# Altium project RaspberryPi.PrjPcb
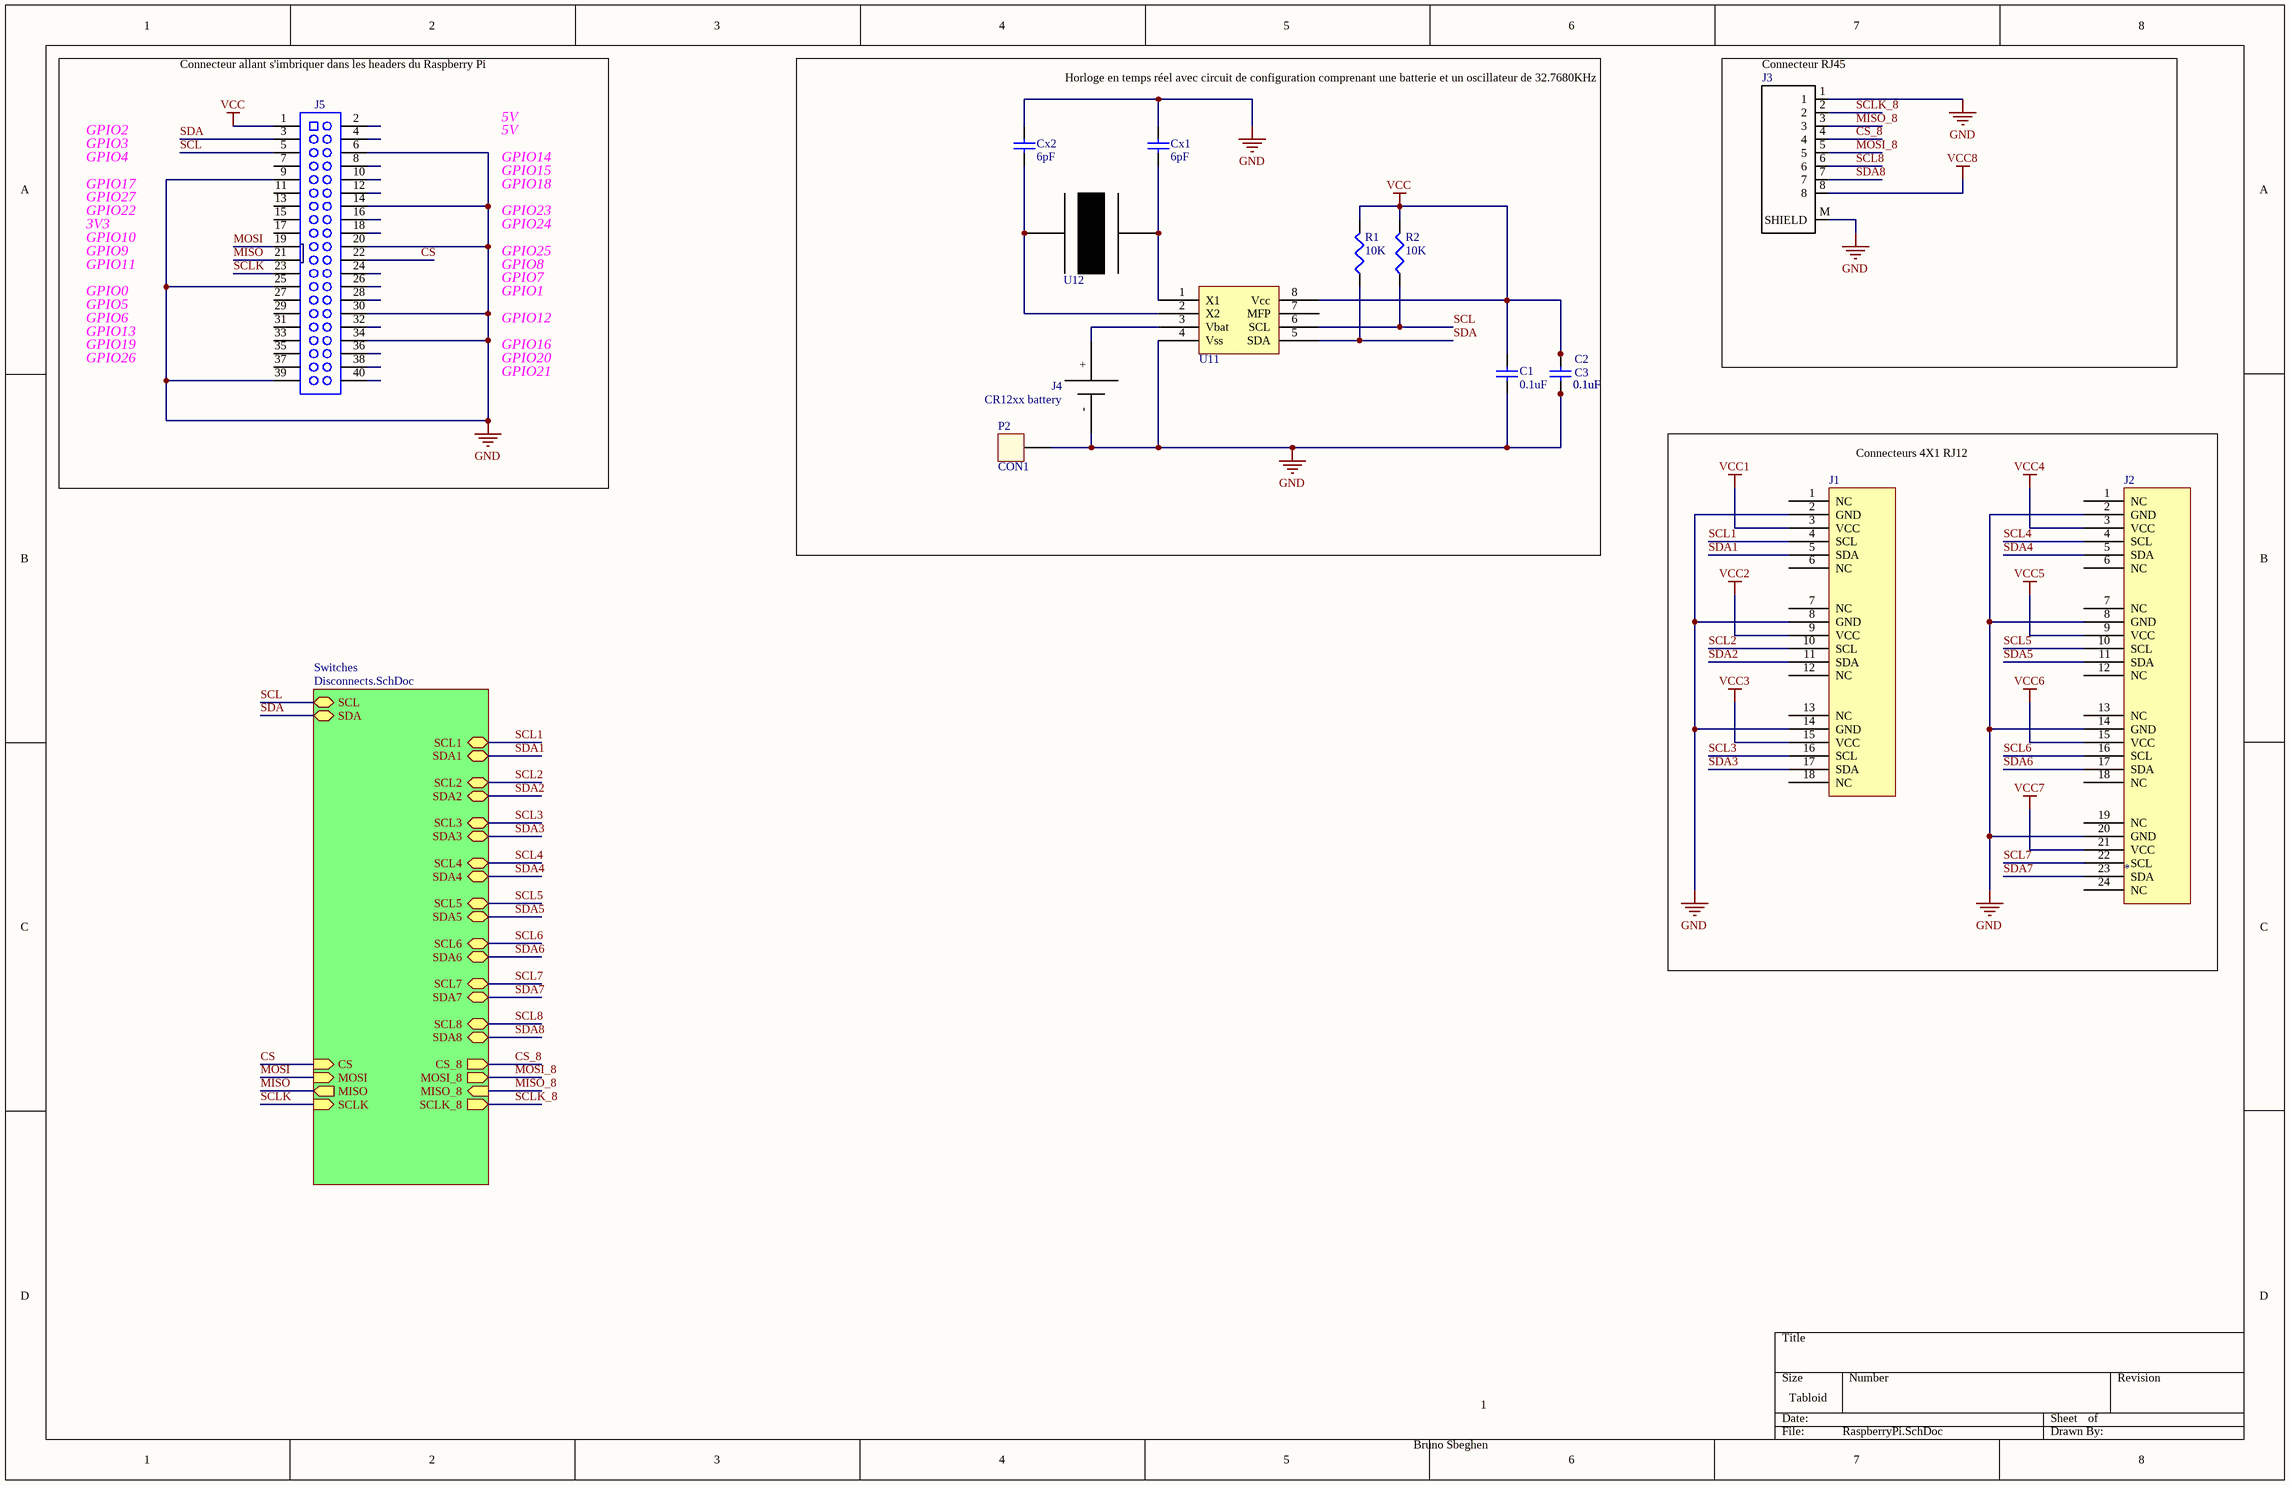
[diagram p0: RaspberryPi.SchDoc]
RevisionGlobal: 1.1; DrawingNumber: MainUnit_Rpi4
2 sheets, 53 parts. Net scope: hierarchical (ports join the sheet entries above them; power ports are global).
Board file: RaspberryPi.PcbDoc
Sheets:
  RaspberryPi.SchDoc
    Switches = Disconnects.SchDoc

## Sheet RaspberryPi.SchDoc
size Tabloid; DocumentNumber: 1; SheetNumber: 1; SheetTotal: 2

### Parts
C1  value 0.1uF  [C0805]  (hidden comment: Cap 0.1uF)
C2  value 0.1uF  [C0805]  (hidden comment: Cap 0.1uF)
C3  value 0.1uF  [C0805]  (hidden comment: Cap 0.1uF)
Cx1  value 6pF  [C0805]  (hidden comment: Cap 6pF)
Cx2  value 6pF  [C0805]  (hidden comment: Cap 6pF)
J1  TM2RE-1818(50)  [TM2RE-1818]  (value not drawn)
J2  *  [TM2RE-2424]
J3  TM3RA-88(50)  [TM3RA-88(50)]  (value not drawn)
J4  CR12xx battery  [BS-1225-PC]
J5  ??  [CONN40_100mils_M20_7812045]  (value not drawn)
P2  CON1  [CONN1_100mils]  (no BOM)
R1  value 10K  [6-0805_N]  (hidden comment: Res 10K)
R2  value 10K  [6-0805_N]  (hidden comment: Res 10K)
U11  *  [MCP79410]  (value not drawn)
U12  *  [ECX-31B]  (value not drawn)

### Blocks framed on the sheet
Connecteur RJ45: J3
Connecteurs 4X1 RJ12: J1 J2

### Sub-sheets
Switches = Disconnects.SchDoc: SCL1 (bidir), SDA1 (bidir), SCL2 (bidir), SDA2 (bidir), SCL3 (bidir), SDA3 (bidir), SCL4 (bidir), SDA4 (bidir), SCL5 (bidir), SDA5 (bidir), SCL6 (bidir), SDA6 (bidir), SCL7 (bidir), SDA (bidir), SCL (bidir), SDA7 (bidir), SCLK_8 (out), SDA8 (bidir), MISO (out), MOSI (in), SCL8 (bidir), CS (in), SCLK (in), CS_8 (out), MOSI_8 (out), MISO_8 (in)

### Nets
GND: C1.1 C2.1 C3.1 Cx1.2 Cx2.2 J1.2(GND) J1.8(GND) J1.14(GND) J2.2(GND) J2.8(GND) J2.14(GND) J2.20(GND) J3.1 J3.M(SHIELD) J4.- J5.6 J5.9 J5.14 J5.20 J5.25 J5.30 J5.34 J5.39 P2.1 U11.4(Vss)
VCC: C1.2 C2.2 C3.2 J5.1 R1.2 R2.2 U11.8(Vcc)
VCC1: J1.3(VCC)
VCC2: J1.9(VCC)
VCC3: J1.15(VCC)
VCC4: J2.3(VCC)
VCC5: J2.9(VCC)
VCC6: J2.15(VCC)
VCC7: J2.21(VCC)
VCC8: J3.8
CS: J5.22 ; sheet Switches/CS
CS_8: J3.4 ; sheet Switches/CS_8
MISO: J5.21 ; sheet Switches/MISO
MISO_8: J3.3 ; sheet Switches/MISO_8
MOSI: J5.19 ; sheet Switches/MOSI
MOSI_8: J3.5 ; sheet Switches/MOSI_8
SCL: J5.5 R2.1 U11.6(SCL) ; sheet Switches/SCL
SCL1: J1.4(SCL) ; sheet Switches/SCL1
SCL2: J1.10(SCL) ; sheet Switches/SCL2
SCL3: J1.16(SCL) ; sheet Switches/SCL3
SCL4: J2.4(SCL) ; sheet Switches/SCL4
SCL5: J2.10(SCL) ; sheet Switches/SCL5
SCL6: J2.16(SCL) ; sheet Switches/SCL6
SCL7: J2.22(SCL) ; sheet Switches/SCL7
SCL8: J3.6 ; sheet Switches/SCL8
SCLK: J5.23 ; sheet Switches/SCLK
SCLK_8: J3.2 ; sheet Switches/SCLK_8
SDA: J5.3 R1.1 U11.5(SDA) ; sheet Switches/SDA
SDA1: J1.5(SDA) ; sheet Switches/SDA1
SDA2: J1.11(SDA) ; sheet Switches/SDA2
SDA3: J1.17(SDA) ; sheet Switches/SDA3
SDA4: J2.5(SDA) ; sheet Switches/SDA4
SDA5: J2.11(SDA) ; sheet Switches/SDA5
SDA6: J2.17(SDA) ; sheet Switches/SDA6
SDA7: J2.23(SDA) ; sheet Switches/SDA7
SDA8: J3.7 ; sheet Switches/SDA8
NetCx1_1: Cx1.1 U11.1(X1) U12.2
NetCx2_1: Cx2.1 U11.2(X2) U12.1
NetJ4_+: J4.+ U11.3(Vbat)

Not connected (* = marked no-connect by the designer): J1 1(NC) 6(NC) 7(NC) 12(NC) 13(NC) 18(NC); J2 1(NC) 6(NC) 7(NC) 12(NC) 13(NC) 18(NC) 19(NC) 24(NC); J5 2 4 7 8 10 11 12 13 15 16 17 18 24 26 27 28 29 31 32 33 35 36 37 38 40; U11 7(MFP)

### Notes on the sheet
- Connecteur allant s'imbriquer dans les headers du Raspberry Pi
- Horloge en temps réel avec circuit de configuration comprenant une batterie et un oscillateur de 32.7680KHz
- GPIO2
- GPIO3
- GPIO4
- 5V
- GPIO14
- GPIO17
- GPIO22
- GPIO27
- 3V3
- GPIO15
- GPIO18
- GPIO23
- GPIO24
- GPIO9
- GPIO10
- GPIO11
- GPIO0
- GPIO25
- GPIO7
- GPIO8
- GPIO1
- GPIO19
- GPIO26
- GPIO5
- GPIO6
- GPIO13
- GPIO16
- GPIO20
- GPIO12
- GPIO21
- 1
- Bruno Sbeghen

### Library data of the parts
C1-C3 = Cap 0.1uF: Capacitor 0.1uF; Published: 8-Jun-2000; LatestRevisionDate: 29-May-2009; LatestRevisionNote: IPC-7351 Footprint Added.; PackageReference: C1206; Publisher: Altium Limited; PackageDescription: Chip Capacitor; Supplier 1: Digi-Key; Supplier1_PN: 478-1395-1-ND
Cx1 Cx2 = Cap 6pF: Capacitor 6pF; Published: 8-Jun-2000; LatestRevisionDate: 29-May-2009; LatestRevisionNote: IPC-7351 Footprint Added.; PackageReference: C1206; Publisher: Altium Limited; PackageDescription: Chip Capacitor; Supplier 1: Digi-Key; Supplier1_PN: 1276-1767-1-ND
J1 = TM2RE-1818(50): Connector MOD JACK 3pos; Supplier 1: Digi-Key; Supplier1_PN: H11272-ND
J2 = TM2RE-2424(50): Connector MOD JACK 4pos; Supplier 1: Digi-Key; Supplier1_PN: H11267-ND
J3 = TM3RA-88(50): Signal Line; Modular; 8 Contacts; 1 Port Through Hole Vertical; MF: Hirose; SnapEDA_Link: *; Price: *; Package: None; MP: TM3RA-88(50); Availability: Good; Value: *; Supplier 1: Digi-Key; Supplier1_PN: H11279-ND
J4 = CONN_BATT_12mm_VERTICAL: 12mm Battery holder; Supplier 1: Digi-Key; Supplier1_PN: BS-1225-PC-ND
J5 = CON40_2x20: IDC Boxed Header, Straight, PCB Mount, Polarised, 40 Way, 2x20, 0.1" Pitch; Mfg: Harwin; Mfg_PN: M20-7812045; Supplier1: Digikey; Supplier1_PN: 952-3218-ND
P2 = CON1: TP; HelpURL: *; Mfg: *; Mfg_PN: *; NI: *; Rating: *; Supplier1: *; Supplier1_PN: *; Tolerance: *; Type: *; Value: *
R1 R2 = Res 10K: Resistor 10K; Published: 8-Jun-2000; LatestRevisionDate: 29-May-2009; LatestRevisionNote: IPC-7351 Footprint Added.; PackageReference: J1-0603; Publisher: Altium Limited; PackageDescription: Chip Resistor; Supplier 1: Digi-Key; Supplier1_PN: 311-10.0KCRCT-ND
U11 = MCP79410: RTC; Supplier 1: Digi-Key; Supplier1_PN: MCP79410T-I/SNCT-ND
U12 = AB38T: Oscillator 32.7680KHz; Supplier 1: Digi-Key; Supplier1_PN: 535-11937-1-ND

## Sheet Disconnects.SchDoc
size Tabloid; DocumentNumber: 2; SheetNumber: 2; SheetTotal: 2
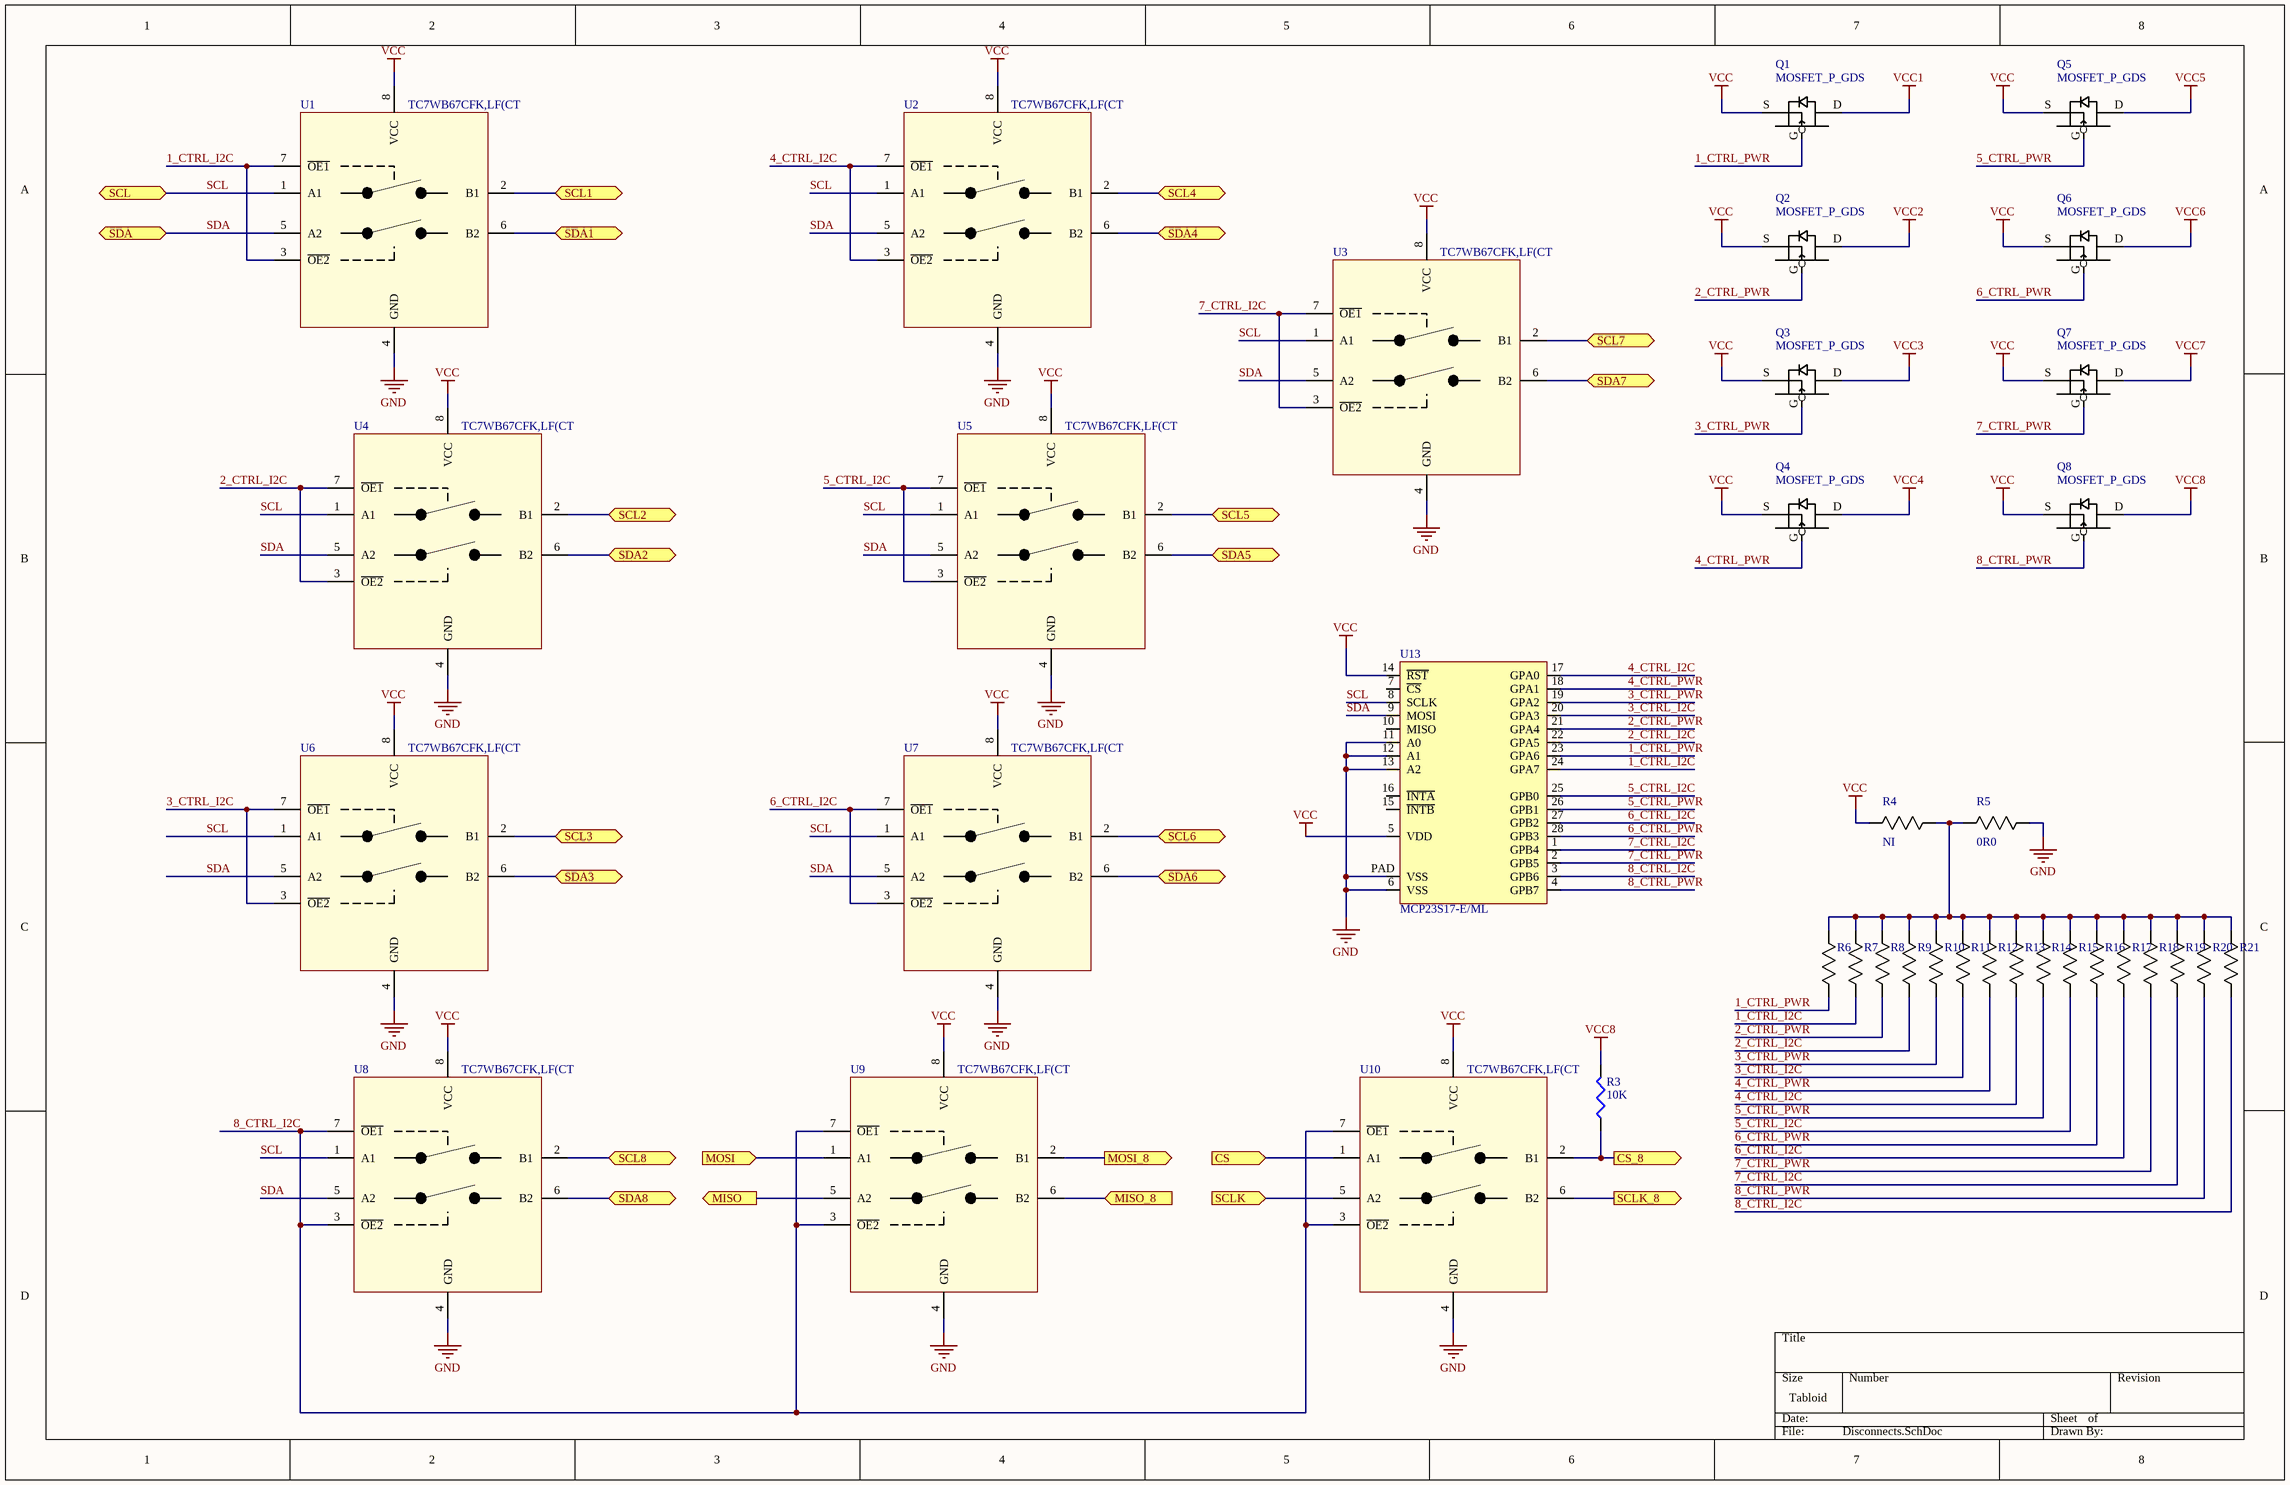
[diagram p1: Disconnects.SchDoc]

### Parts
Q1  MOSFET_P_GDS  [SC70_GDS]
Q2  MOSFET_P_GDS  [SC70_GDS]
Q3  MOSFET_P_GDS  [SC70_GDS]
Q4  MOSFET_P_GDS  [SC70_GDS]
Q5  MOSFET_P_GDS  [SC70_GDS]
Q6  MOSFET_P_GDS  [SC70_GDS]
Q7  MOSFET_P_GDS  [SC70_GDS]
Q8  MOSFET_P_GDS  [SC70_GDS]
R3  value 10K  [6-0805_N]  (hidden comment: Res 10K)
R4  Resistor  [0603]  (value not drawn)
R5  value 0R0  [0603]  (hidden comment: Resistor)
R6  Resistor  [0603]  (value not drawn)
R7  Resistor  [0603]  (value not drawn)
R8  Resistor  [0603]  (value not drawn)
R9  Resistor  [0603]  (value not drawn)
R10  Resistor  [0603]  (value not drawn)
R11  Resistor  [0603]  (value not drawn)
R12  Resistor  [0603]  (value not drawn)
R13  Resistor  [0603]  (value not drawn)
R14  Resistor  [0603]  (value not drawn)
R15  Resistor  [0603]  (value not drawn)
R16  Resistor  [0603]  (value not drawn)
R17  Resistor  [0603]  (value not drawn)
R18  Resistor  [0603]  (value not drawn)
R19  Resistor  [0603]  (value not drawn)
R20  Resistor  [0603]  (value not drawn)
R21  Resistor  [0603]  (value not drawn)
U1  Mfg_PN: TC7WB67CFK,LF(CT  [PSOP8]  (hidden comment: TC7WB67CFK,LF)
U2  Mfg_PN: TC7WB67CFK,LF(CT  [PSOP8]  (hidden comment: TC7WB67CFK,LF)
U3  Mfg_PN: TC7WB67CFK,LF(CT  [PSOP8]  (hidden comment: TC7WB67CFK,LF)
U4  Mfg_PN: TC7WB67CFK,LF(CT  [PSOP8]  (hidden comment: TC7WB67CFK,LF)
U5  Mfg_PN: TC7WB67CFK,LF(CT  [PSOP8]  (hidden comment: TC7WB67CFK,LF)
U6  Mfg_PN: TC7WB67CFK,LF(CT  [PSOP8]  (hidden comment: TC7WB67CFK,LF)
U7  Mfg_PN: TC7WB67CFK,LF(CT  [PSOP8]  (hidden comment: TC7WB67CFK,LF)
U8  Mfg_PN: TC7WB67CFK,LF(CT  [PSOP8]  (hidden comment: TC7WB67CFK,LF)
U9  Mfg_PN: TC7WB67CFK,LF(CT  [PSOP8]  (hidden comment: TC7WB67CFK,LF)
U10  Mfg_PN: TC7WB67CFK,LF(CT  [PSOP8]  (hidden comment: TC7WB67CFK,LF)
U13  MCP23S17-E/ML  [QFN28-S]

### Ports
CS (in), CS_8 (out), MISO (out), MISO_8 (in), MOSI (in), MOSI_8 (out), SCL1 (bidir), SCL2 (bidir), SCL3 (bidir), SCL4 (bidir), SCL5 (bidir), SCL6 (bidir), SCL7 (bidir), SCL8 (bidir), SCL (bidir), SCLK (in), SCLK_8 (out), SDA1 (bidir), SDA2 (bidir), SDA3 (bidir), SDA4 (bidir), SDA5 (bidir), SDA6 (bidir), SDA7 (bidir), SDA8 (bidir), SDA (bidir)

### Nets
GND: R5.2 U1.4(GND) U2.4(GND) U3.4(GND) U4.4(GND) U5.4(GND) U6.4(GND) U7.4(GND) U8.4(GND) U9.4(GND) U10.4(GND) U13.6(VSS) U13.11(A0) U13.12(A1) U13.13(A2) U13.PAD(VSS)
VCC: Q1.S Q2.S Q3.S Q4.S Q5.S Q6.S Q7.S Q8.S R4.1 U1.8(VCC) U2.8(VCC) U3.8(VCC) U4.8(VCC) U5.8(VCC) U6.8(VCC) U7.8(VCC) U8.8(VCC) U9.8(VCC) U10.8(VCC) U13.5(VDD) U13.14(~{RST})
VCC1: Q1.D
VCC2: Q2.D
VCC3: Q3.D
VCC4: Q4.D
VCC5: Q5.D
VCC6: Q6.D
VCC7: Q7.D
VCC8: Q8.D R3.2
1_CTRL_I2C: R7.2 U1.3(~{OE2}) U1.7(~{OE1}) U13.24(GPA7)
1_CTRL_PWR: Q1.G R6.2 U13.23(GPA6)
2_CTRL_I2C: R9.2 U4.3(~{OE2}) U4.7(~{OE1}) U13.22(GPA5)
2_CTRL_PWR: Q2.G R8.2 U13.21(GPA4)
3_CTRL_I2C: R11.2 U6.3(~{OE2}) U6.7(~{OE1}) U13.20(GPA3)
3_CTRL_PWR: Q3.G R10.2 U13.19(GPA2)
4_CTRL_I2C: R13.2 U2.3(~{OE2}) U2.7(~{OE1}) U13.17(GPA0)
4_CTRL_PWR: Q4.G R12.2 U13.18(GPA1)
5_CTRL_I2C: R15.2 U5.3(~{OE2}) U5.7(~{OE1}) U13.25(GPB0)
5_CTRL_PWR: Q5.G R14.2 U13.26(GPB1)
6_CTRL_I2C: R17.2 U7.3(~{OE2}) U7.7(~{OE1}) U13.27(GPB2)
6_CTRL_PWR: Q6.G R16.2 U13.28(GPB3)
7_CTRL_I2C: R19.2 U3.3(~{OE2}) U3.7(~{OE1}) U13.1(GPB4)
7_CTRL_PWR: Q7.G R18.2 U13.2(GPB5)
8_CTRL_I2C: R21.2 U8.3(~{OE2}) U8.7(~{OE1}) U9.3(~{OE2}) U9.7(~{OE1}) U10.3(~{OE2}) U10.7(~{OE1}) U13.3(GPB6)
8_CTRL_PWR: Q8.G R20.2 U13.4(GPB7)
CS: U10.1(A1) ; port CS
CS_8: R3.1 U10.2(B1) ; port CS_8
MISO: U9.5(A2) ; port MISO
MISO_8: U9.6(B2) ; port MISO_8
MOSI: U9.1(A1) ; port MOSI
MOSI_8: U9.2(B1) ; port MOSI_8
SCL: U1.1(A1) U2.1(A1) U3.1(A1) U4.1(A1) U5.1(A1) U6.1(A1) U7.1(A1) U8.1(A1) U13.8(SCLK) ; port SCL
SCL1: U1.2(B1) ; port SCL1
SCL2: U4.2(B1) ; port SCL2
SCL3: U6.2(B1) ; port SCL3
SCL4: U2.2(B1) ; port SCL4
SCL5: U5.2(B1) ; port SCL5
SCL6: U7.2(B1) ; port SCL6
SCL7: U3.2(B1) ; port SCL7
SCL8: U8.2(B1) ; port SCL8
SCLK: U10.5(A2) ; port SCLK
SCLK_8: U10.6(B2) ; port SCLK_8
SDA: U1.5(A2) U2.5(A2) U3.5(A2) U4.5(A2) U5.5(A2) U6.5(A2) U7.5(A2) U8.5(A2) U13.9(MOSI) ; port SDA
SDA1: U1.6(B2) ; port SDA1
SDA2: U4.6(B2) ; port SDA2
SDA3: U6.6(B2) ; port SDA3
SDA4: U2.6(B2) ; port SDA4
SDA5: U5.6(B2) ; port SDA5
SDA6: U7.6(B2) ; port SDA6
SDA7: U3.6(B2) ; port SDA7
SDA8: U8.6(B2) ; port SDA8
NetR4_2: R4.2 R5.1 R6.1 R7.1 R8.1 R9.1 R10.1 R11.1 R12.1 R13.1 R14.1 R15.1 R16.1 R17.1 R18.1 R19.1 R20.1 R21.1

Not connected (* = marked no-connect by the designer): U13 7(~{CS}) 10(MISO) 15(~{INTB}) 16(~{INTA})

### Library data of the parts
Q1-Q8 = MOSFET_P_GDS: PMOS; Mfg: OnSemi; Mfg_PN: NTS4101PT1G; HelpURL: *; NI: *; Rating: *; Supplier1: Digikey; Supplier1_PN: NTS4101PT1GOSCT-ND; Tolerance: *; Type: *; Value: *
R3 = Res 10K: Resistor 10K; Published: 8-Jun-2000; LatestRevisionDate: 29-May-2009; LatestRevisionNote: IPC-7351 Footprint Added.; PackageReference: J1-0603; Publisher: Altium Limited; PackageDescription: Chip Resistor; Supplier 1: Digi-Key; Supplier1_PN: 311-10.0KCRCT-ND
R4 R6-R21 = Resistor: Mfg: Bourns; Mfg_PN: CR0603-JW-104ELF; Value: 100k; HelpURL: *; Supplier1: Digikey; Supplier1_PN: CR0603-JW-104ELFCT-ND; Type: *; Rating: *; Tolerance: *
  R4: NI: NI
  R6-R21: NI: *
R5 = Resistor: Mfg: KOA; Mfg_PN: RK73Z1JTTD; HelpURL: *; NI: *; Supplier1: Digikey; Supplier1_PN: 2019-RK73Z1JTTDCT-ND; Type: *; Rating: *; Tolerance: *
U1-U10 = TC7WB67CFK,LF: Dual analog switch; Mfg: Toshiba; HelpURL: *; NI: *; Rating: *; Supplier1: Digikey; Supplier1_PN: TC7WB67CFKLF(CTCT-ND; Tolerance: *; Type: *; Value: *
U13 = MCP23S17-E/ML: 16-Bit SPI I/O Expander; Mfg: Microchip; Mfg_PN: MCP23017-E/ML; Supplier1: Digikey; Supplier1_PN: MCP23017-E/ML-ND

## Nets that join several sheets
GND: RaspberryPi (25 pins), Disconnects (16 pins)
VCC: RaspberryPi (7 pins), Disconnects (21 pins)
VCC1: RaspberryPi (J1.3), Disconnects (Q1.D)
VCC2: RaspberryPi (J1.9), Disconnects (Q2.D)
VCC3: RaspberryPi (J1.15), Disconnects (Q3.D)
VCC4: RaspberryPi (J2.3), Disconnects (Q4.D)
VCC5: RaspberryPi (J2.9), Disconnects (Q5.D)
VCC6: RaspberryPi (J2.15), Disconnects (Q6.D)
VCC7: RaspberryPi (J2.21), Disconnects (Q7.D)
VCC8: RaspberryPi (J3.8), Disconnects (Q8.D R3.2)
CS: RaspberryPi (J5.22), Disconnects (U10.1)
CS_8: RaspberryPi (J3.4), Disconnects (R3.1 U10.2)
MISO: RaspberryPi (J5.21), Disconnects (U9.5)
MISO_8: RaspberryPi (J3.3), Disconnects (U9.6)
MOSI: RaspberryPi (J5.19), Disconnects (U9.1)
MOSI_8: RaspberryPi (J3.5), Disconnects (U9.2)
SCL: RaspberryPi (J5.5 R2.1 U11.6), Disconnects (9 pins)
SCL1: RaspberryPi (J1.4), Disconnects (U1.2)
SCL2: RaspberryPi (J1.10), Disconnects (U4.2)
SCL3: RaspberryPi (J1.16), Disconnects (U6.2)
SCL4: RaspberryPi (J2.4), Disconnects (U2.2)
SCL5: RaspberryPi (J2.10), Disconnects (U5.2)
SCL6: RaspberryPi (J2.16), Disconnects (U7.2)
SCL7: RaspberryPi (J2.22), Disconnects (U3.2)
SCL8: RaspberryPi (J3.6), Disconnects (U8.2)
SCLK: RaspberryPi (J5.23), Disconnects (U10.5)
SCLK_8: RaspberryPi (J3.2), Disconnects (U10.6)
SDA: RaspberryPi (J5.3 R1.1 U11.5), Disconnects (9 pins)
SDA1: RaspberryPi (J1.5), Disconnects (U1.6)
SDA2: RaspberryPi (J1.11), Disconnects (U4.6)
SDA3: RaspberryPi (J1.17), Disconnects (U6.6)
SDA4: RaspberryPi (J2.5), Disconnects (U2.6)
SDA5: RaspberryPi (J2.11), Disconnects (U5.6)
SDA6: RaspberryPi (J2.17), Disconnects (U7.6)
SDA7: RaspberryPi (J2.23), Disconnects (U3.6)
SDA8: RaspberryPi (J3.7), Disconnects (U8.6)